# Altium schematic sheet Header.SchDoc
size A3; Address1: 30 Place d'italie; Address2: 75013 PARIS; Address3: FRANCE; DocumentNumber: 1; SheetNumber: 1; SheetTotal: 3; Diffusion: Diffusion
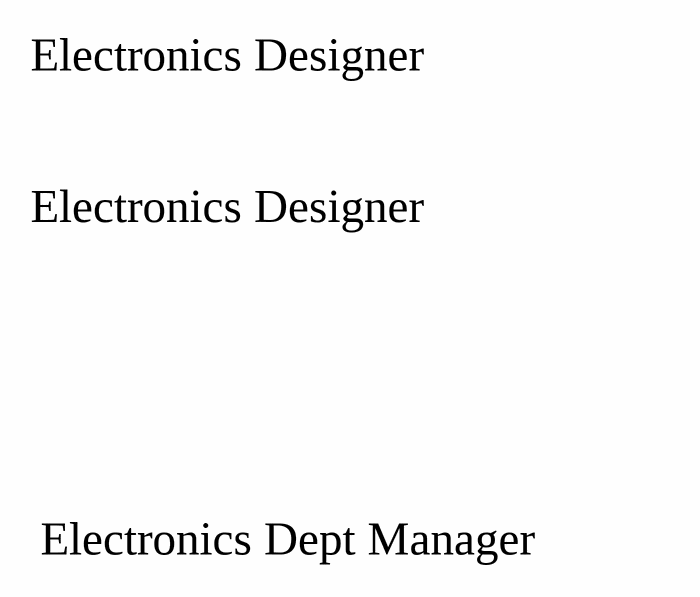
[diagram p0: Header.SchDoc]

## Parts
?  (no value)  (graphical)

## Notes on the sheet
- Electronics Designer
- Electronics Dept Manager
- PCB REF. :
- ASM REF. :
- INDEX :
- Name
- Position
- Date
- Signature
- WRITTEN BY
- CHECKED BY
- APPROVED BY
- CONFIDENTIAL
- DIFFUSION :

## Library data of the parts
? = Title_ech_3: Echosens